# EAGLE design rapidshark-flywheel-controller-mk-1.2 (EAGLE 6.5.0)
AUTHOR: sean@yak.net
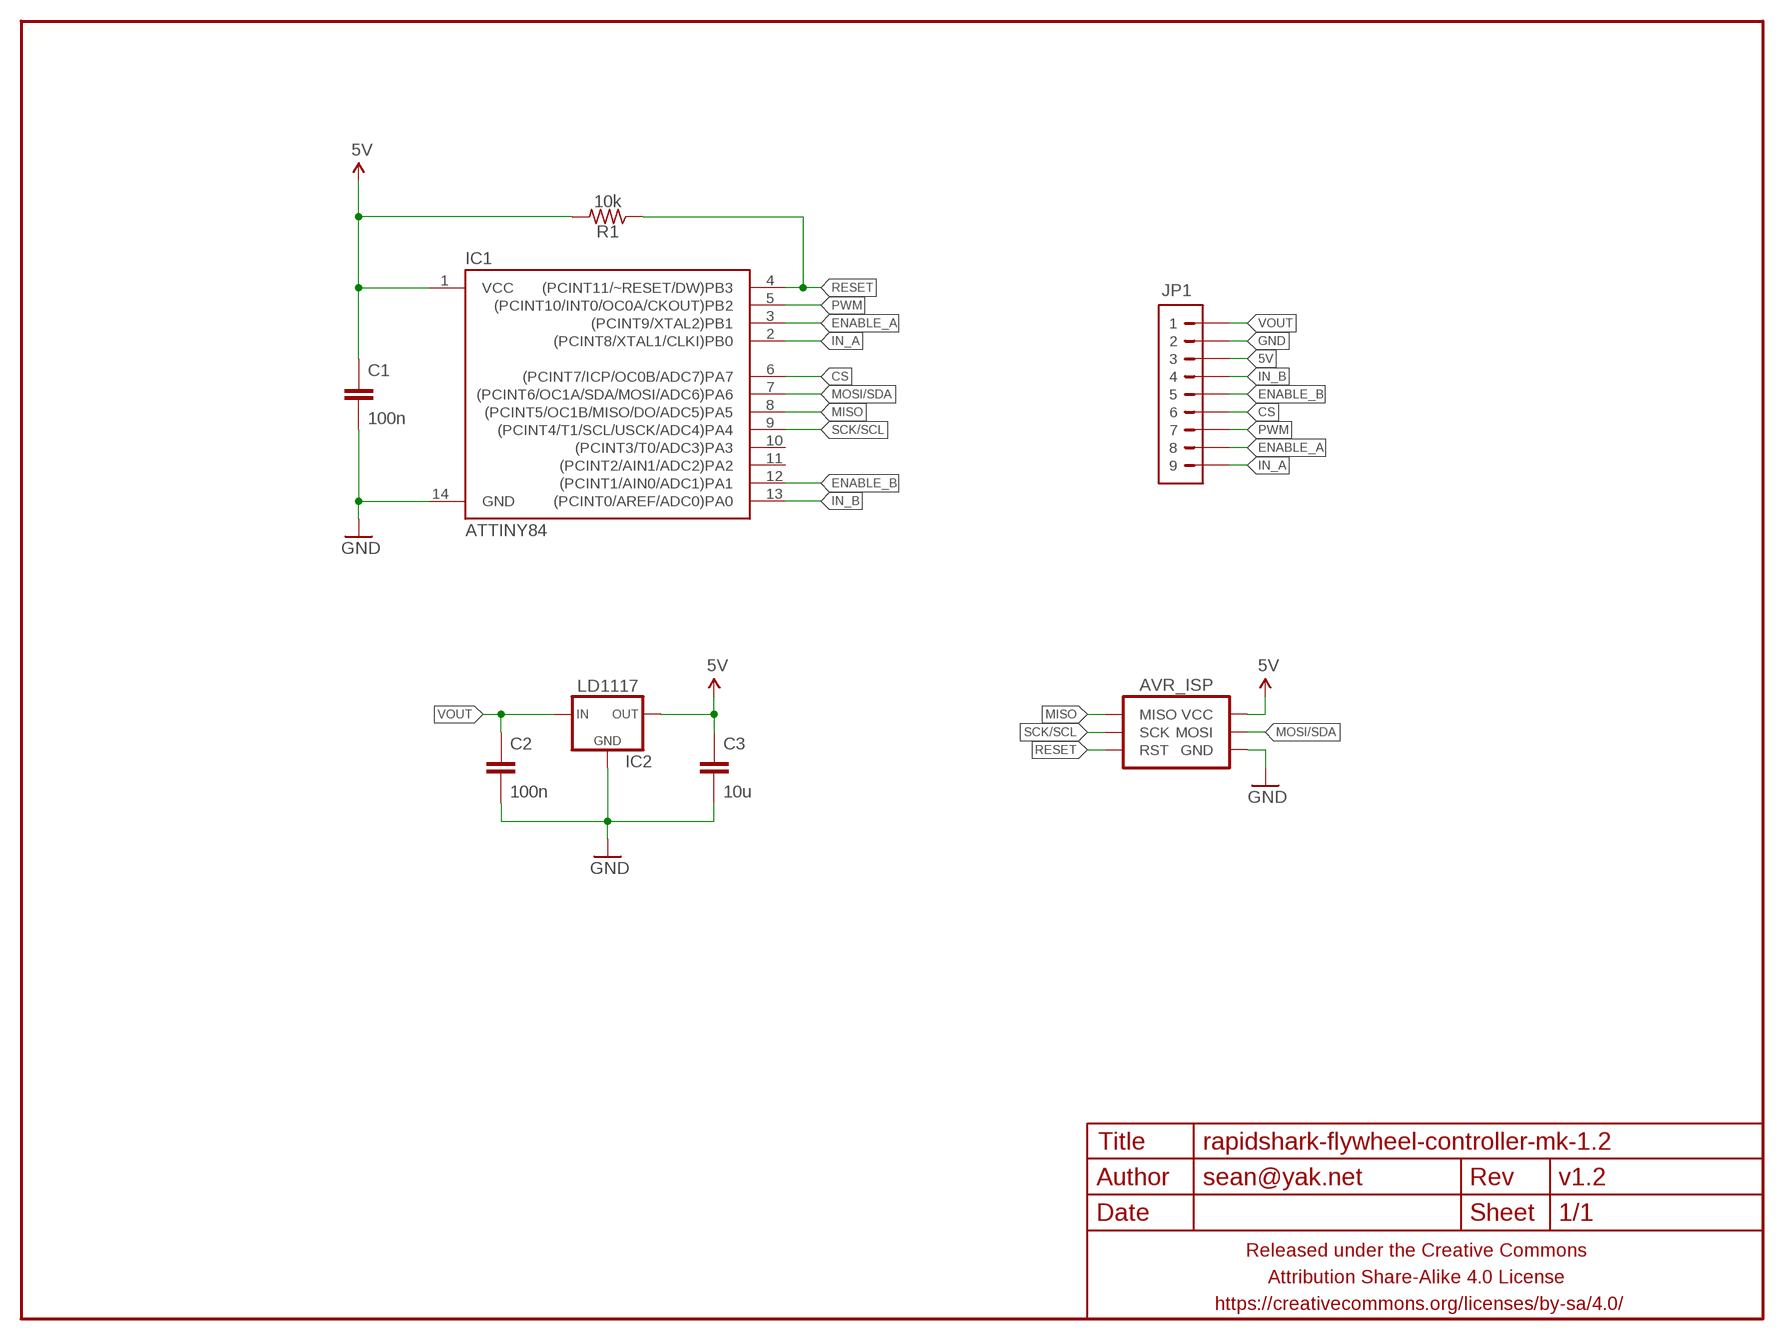
[diagram p0: schematic, sheet 1]

## Parts
AVR_ISP  AVR_SPI_PRG_6JST-PH-VERT-PTH1  [JST-6-PH-VERT-PTH]
C1  100n  CAPACITOR-CERAMICC0805  [C0805]
C2  100n  CAPACITOR-CERAMICC0805  [C0805]
C3  10u  CAPACITOR-CERAMICC1206  [C1206]
FRAME1  FRAME-LETTERNO_PACKAGE  [DUMMY]
IC1  ATTINY84  [SO14]
IC2  LD1117  V_REG_78XXSOT-223  [SOT223]
JP1  M09CENTERED  [1X09-CENTERED]
R1  10k  RESISTORR0805  [R0805]

## Nets
5V: AVR_ISP.1(VCC) C1.1 C3.1 IC1.1(VCC) IC2.2(OUT) IC2.4(OUT) JP1.3 R1.2
CS: IC1.6((PCINT7/ICP/OC0B/ADC7)PA7) JP1.6
ENABLE_A: IC1.3((PCINT9/XTAL2)PB1) JP1.8
ENABLE_B: IC1.12((PCINT1/AIN0/ADC1)PA1) JP1.5
GND: AVR_ISP.6(GND) C1.2 C2.2 C3.2 IC1.14(GND) IC2.1(GND) JP1.2
IN_A: IC1.2((PCINT8/XTAL1/CLKI)PB0) JP1.9
IN_B: IC1.13((PCINT0/AREF/ADC0)PA0) JP1.4
MISO: AVR_ISP.2(MISO) IC1.8((PCINT5/OC1B/MISO/DO/ADC5)PA5)
MOSI/SDA: AVR_ISP.4(MOSI) IC1.7((PCINT6/OC1A/SDA/MOSI/ADC6)PA6)
PWM: IC1.5((PCINT10/INT0/OC0A/CKOUT)PB2) JP1.7
RESET: AVR_ISP.5(RST) IC1.4((PCINT11/~RESET/DW)PB3) R1.1
SCK/SCL: AVR_ISP.3(SCK) IC1.9((PCINT4/T1/SCL/USCK/ADC4)PA4)
VOUT: C2.1 IC2.3(IN) JP1.1
Unconnected: IC1.10((PCINT3/T0/ADC3)PA3) IC1.11((PCINT2/AIN1/ADC2)PA2)

## Library data of the parts
AVR_ISP = A_butts:AVR_SPI_PRG_6: AVR ISP 6 Pin This is the reduced ISP connector for AVR programming. Common on Arduino. This footprint will take up less PCB space and can be used with a 10-pin to 6-pin adapter such as SKU: BOB-08508 **Special note about "TEST_POINT" package. The stop mask is on the top side, so if you want your programming test points to be on the bottom of your board, make sure to place this package on the bottom side of the board. This also ensure that the orientation to program from the bottom side will be correct.
C1-C3 = A_butts:CAPACITOR-CERAMIC: CAPACITOR, European symbol
FRAME1 = A_butts:FRAME-LETTER: Schematic Frame Standard 8.5x11 US Letter frame; DESIGNER: sean@yak.net; VERSION: v1.2
IC1 = A_butts:ATTINY84: Atmel 14-pin 2/4/8kB flash uC
IC2 = A_butts:V_REG_78XX: Voltage Regulator Standard 7805 5V regulator. IGO (Input Ground Output). Spark Fun Electronics SKU : COM-00107
JP1 = A_butts:M09
R1 = A_butts:RESISTOR: RESISTOR, American symbol

## Board
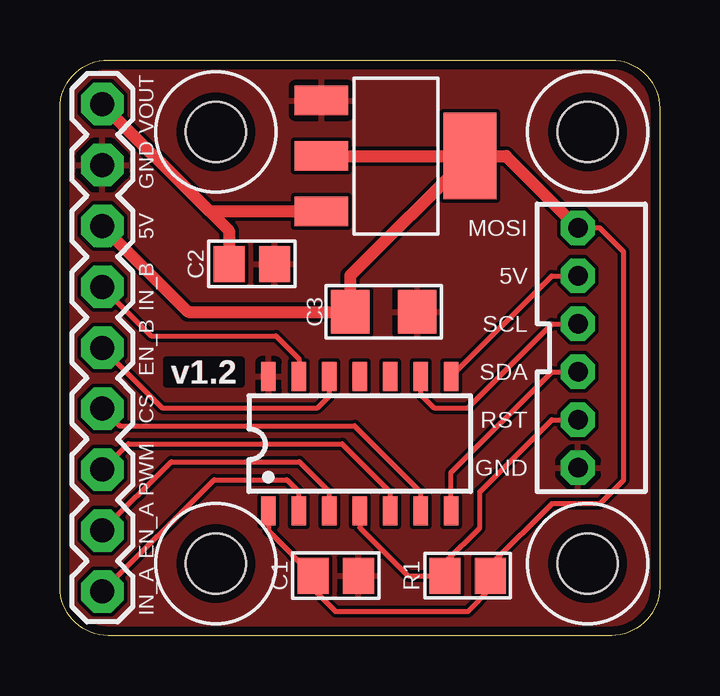
[diagram p1: board, top side]
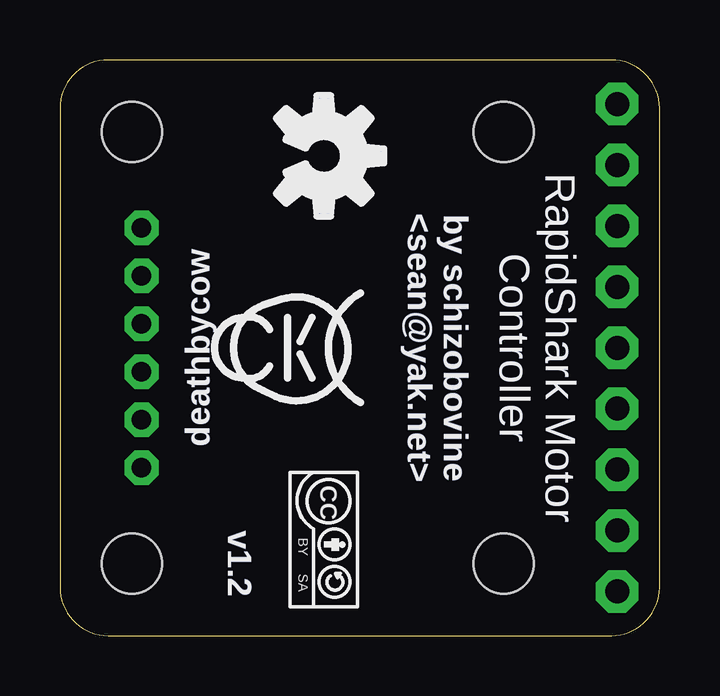
[diagram p2: board, bottom side, seen from below]

Size 25 x 24 mm. Coordinates in mm from the lower left corner, seen from the top.
Outline: 2,24 23,24 arc-90 25,22 25,2 arc-90 23,0 2,0 arc-90 0,2 0,22 arc-90 2,24
Copper layers (1*16): Top 0.0356mm / dielectric 1.5011mm / Bottom 0.0356mm
Design rules "LaenPCBOrder_2": minimum track width 6mil, minimum drill 13mil, track to track 6mil, track to pad 6mil, pad to pad 6mil, via to via 6mil, smd to smd 6mil, copper to edge 15mil, drill to drill 6mil, minimum pad ring 7mil, minimum via ring 7mil, stop-mask expansion 3mil, vias tented up to drill 20mil, thermal gap 10mil
Holes 2.5 mm at 6.5,21 22,21 6.5,3 22,3

### Footprints (pad centres in the part's own frame; a part is rotated, then mirrored left to right if it is on the bottom)
JST-6-PH-VERT-PTH = drill 0.8 pad 1.422 octagon: 1 -5,0; 2 -3,0; 3 -1,0; 4 1,0; 5 3,0; 6 5,0
C0805 = smd 1.3 x 1.5: 1 -0.95,0; 2 0.95,0
C1206 = smd 1.6 x 1.8: 1 -1.4,0; 2 1.4,0
SO14 = smd 0.6 x 1.2: 1 -3.81,-2.8; 2 -2.54,-2.8; 3 -1.27,-2.8; 4 0,-2.8; 5 1.27,-2.8; 6 2.54,-2.8; 7 3.81,-2.8; 8 3.81,2.8; 9 2.54,2.8; 10 1.27,2.8; 11 0,2.8; 12 -1.27,2.8; 13 -2.54,2.8; 14 -3.81,2.8
SOT223 = smd 1.219 x 2.235: 1 -2.311,-3.099; 2 0,-3.099; 3 2.311,-3.099 | smd 3.6 x 2.2: 4 0,3.099
1X09-CENTERED = drill 1 pad 1.778 octagon: 1 -10.16,0; 2 -7.62,0; 3 -5.08,0; 4 -2.54,0; 5 0,0; 6 2.54,0; 7 5.08,0; 8 7.62,0; 9 10.16,0
R0805 = smd 1.3 x 1.5: 1 -0.95,0; 2 0.95,0

### Placement (x,y rotation side)
AVR_ISP  21.6,12 270 top
C1  11.5,2.5 0 top
C2  8,15.5 0 top
C3  13.5,13.5 0 top
FRAME1  0,0 0 bottom
IC1  12.5,8 0 top
IC2  14,20 270 top
JP1  1.77,12 270 top
R1  17,2.5 0 top
U$1  [CC-BY-SA-4.0-NO-URL]  14,4 270 bottom
U$2  [COW_SMALL_METAL]  15,12 270 bottom
U$3  [OSHWLOGO_TOP_0.2]  14,20 270 bottom

### Tracks (layer width: path | path; a pad name or v marks a point on that pad's centre or on a via)
5V
  Top 0.2: AVR_ISP.1 22.5,17 23.5,16 23.5,6.5 22.5,5.5 20.5,5.5 17.95,2.95 R1.2 17.95,1.95 17,1 11.5,1 10.55,1.95 C1.1 8.69,4.36 IC1.1
  Top 0.5: IC2.2 IC2.4 | IC2.4 18.6,20 AVR_ISP.1 | JP1.3 5.35,13.5 C3.1 12.1,15 IC2.4
CS
  Top 0.2: IC1.6 15.04,6 12.29,8.75 2.48,8.75 JP1.6
ENABLE_A
  Top 0.2: IC1.3 11.23,6 9.98,7.25 4.64,7.25 JP1.8
ENABLE_B
  Top 0.2: IC1.12 11.23,10 10.73,9.5 4.27,9.5 JP1.5
GND
  pour Top (rank 6): 0,0 0,24 25,24 25,0
IN_A
  Top 0.2: IC1.2 9.96,6 9.46,6.5 6.43,6.5 JP1.9
IN_B
  Top 0.2: JP1.4 3.81,12.5 9,12.5 9.96,11.54 IC1.13
MISO
  Top 0.2: IC1.8 20.51,15 AVR_ISP.2
MOSI/SDA
  Top 0.2: IC1.7 16.31,6.81 20.5,11 AVR_ISP.4
PWM
  Top 0.2: IC1.5 13.77,6 11.77,8 2.85,8 JP1.7
RESET
  Top 0.2: IC1.4 12.5,4.5 14.5,2.5 R1.1 16.05,3.05 17.5,4.5 17.5,6 20.5,9 AVR_ISP.5
SCK/SCL
  Top 0.2: IC1.9 15.04,10.06 15.6,9.5 17,9.5 20.5,13 AVR_ISP.3
VOUT
  Top 0.5: JP1.1 6.24,17.69 | 6.24,17.69 IC2.3 | 6.24,17.69 7.05,16.88 C2.1

### Text on the board
Bottom: RapidShark Motor / Controller | by schizobovine / <sean@yak.net>
tPlace: VOUT | GND | 5V | MOSI | IN_B | 5V | SCL | EN_B | SDA | CS | RST | PWM | GND | EN_A | IN_A
bPlace: RapidShark Motor / Controller | by schizobovine / <sean@yak.net>